# EAGLE schematic Rocket-Control (EAGLE 7.6.0)
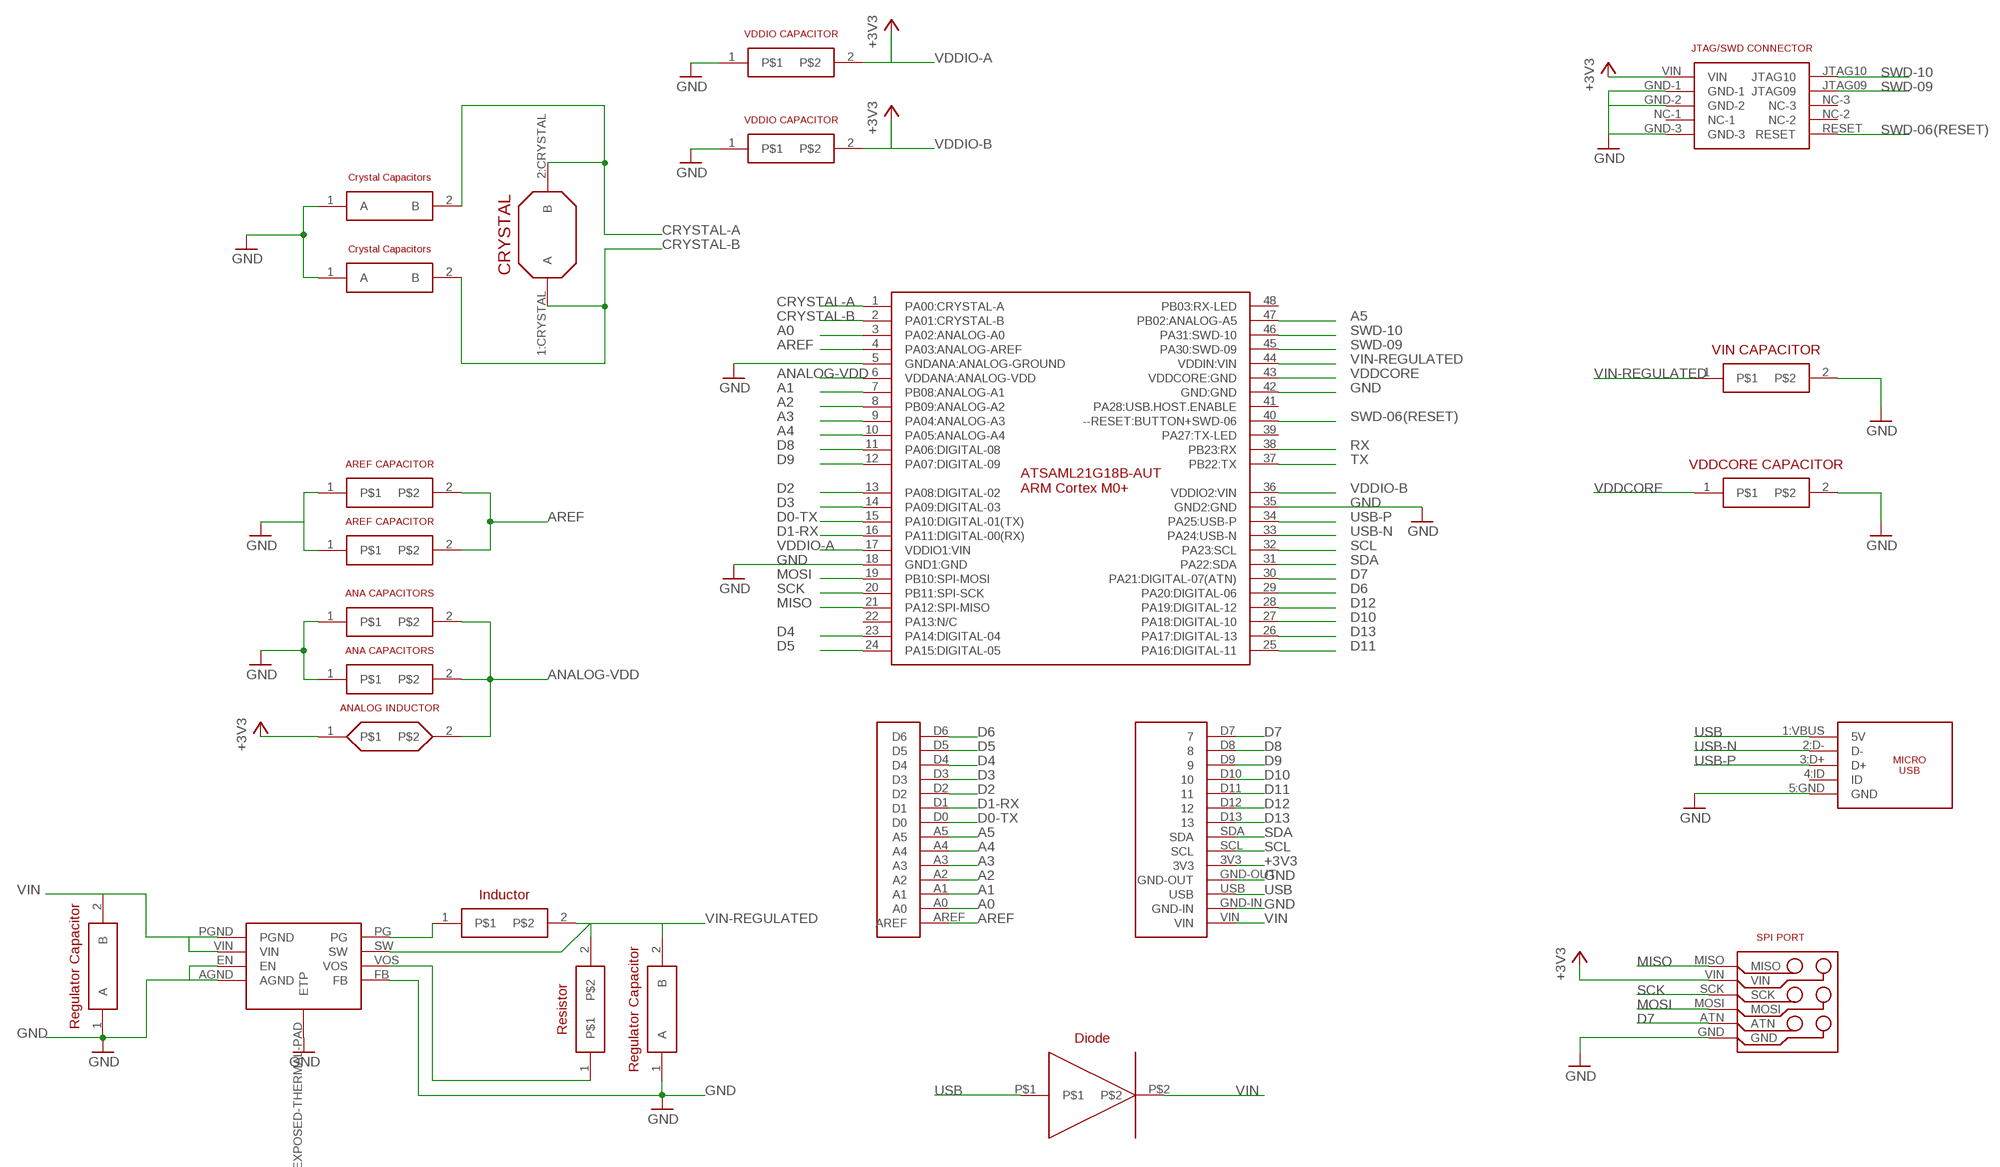
[diagram p0: schematic, sheet 1]

## Parts
U$1  ATSAML21G18B-AUT  [TQFP48]
U$2  CRYSTAL-CAPACITORS  [C0603]
U$3  CRYSTAL-CAPACITORS  [C0603]
U$4  CRYSTAL  [4-SOJ:CRYSTAL]
U$5  REGULATOR  [8-WFDFN-EXPOSED-PAD]
U$6  AREF-CAPACITORS  [C0603]
U$7  AREF-CAPACITORS  [C0603]
U$8  ANALOG-CAPACITORS  [C0603]
U$9  ANALOG-CAPACITORS  [C0603]
U$10  ANALOG-INDUCTOR  [C0603]
U$11  REGULATOR-CAPACITORS  [C0603]
U$12  REGULATOR-CAPACITORS  [C0603]
U$13  REGULATOR-INDUCTOR  [C0603]
U$14  REGULATOR-RESISTOR  [C0603]
U$15  REGULATION-DIODE  [SOD-882]
U$21  HEADER-SIDE-A  [HEADER-SIDE-A]
U$22  HEADER-SIDE-B  [HEADER-SIDE-B]
U$26  VDDIO-CAPACITOR  [C0603]
U$35  VDDIO-CAPACITOR  [C0603]
U$38  10118194-0001LF:MICRO-USB  [10118194-0001LF:MICRO-USB-B]
U$41  SPI-PORT  [SPI-PORT]
U$56  VDDCORE-CAPACITOR  [C0603]
U$57  VIN-CAPACITOR  [C0603]
U$61  JTAG-MINI  [JTAG-MINI]

## Nets
+3V3: U$10.1 U$22.3V3 U$41.VIN U$61.VIN
A0: U$1.3(PA02:ANALOG-A0) U$21.A0
A1: U$1.7(PB08:ANALOG-A1) U$21.A1
A2: U$1.8(PB09:ANALOG-A2) U$21.A2
A3: U$1.9(PA04:ANALOG-A3) U$21.A3
A4: U$1.10(PA05:ANALOG-A4) U$21.A4
A5: U$1.47(PB02:ANALOG-A5) U$21.A5
ANALOG-VDD: U$1.6(VDDANA:ANALOG-VDD) U$8.2 U$9.2 U$10.2
AREF: U$1.4(PA03:ANALOG-AREF) U$6.2 U$7.2 U$21.AREF
CRYSTAL-A: U$1.1(PA00:CRYSTAL-A) U$2.2(B) U$4.2:CRYSTAL(B)
CRYSTAL-B: U$1.2(PA01:CRYSTAL-B) U$3.2(B) U$4.1:CRYSTAL(A)
D0-TX: U$1.15(PA10:DIGITAL-01(TX)) U$21.D0
D1-RX: U$1.16(PA11:DIGITAL-00(RX)) U$21.D1
D2: U$1.13(PA08:DIGITAL-02) U$21.D2
D3: U$1.14(PA09:DIGITAL-03) U$21.D3
D4: U$1.23(PA14:DIGITAL-04) U$21.D4
D5: U$1.24(PA15:DIGITAL-05) U$21.D5
D6: U$1.29(PA20:DIGITAL-06) U$21.D6
D7: U$1.30(PA21:DIGITAL-07(ATN)) U$22.D7 U$41.ATN
D8: U$1.11(PA06:DIGITAL-08) U$22.D8
D9: U$1.12(PA07:DIGITAL-09) U$22.D9
D10: U$1.27(PA18:DIGITAL-10) U$22.D10
D11: U$1.25(PA16:DIGITAL-11) U$22.D11
D12: U$1.28(PA19:DIGITAL-12) U$22.D12
D13: U$1.26(PA17:DIGITAL-13) U$22.D13
GND: U$1.5(GNDANA:ANALOG-GROUND) U$1.18(GND1:GND) U$1.35(GND2:GND) U$1.42(GND:GND) U$2.1(A) U$3.1(A) U$5.AGND U$5.EN U$5.EXPOSED-THERMAL-PAD(ETP) U$5.FB U$6.1 U$7.1 U$8.1 U$9.1 U$11.1(A) U$12.1(A) U$22.GND-IN U$22.GND-OUT U$26.1 U$35.1 U$38.5:GND(GND) U$41.GND U$56.2 U$57.2 U$61.GND-1 U$61.GND-2 U$61.GND-3
MISO: U$1.21(PA12:SPI-MISO) U$41.MISO
MOSI: U$1.19(PB10:SPI-MOSI) U$41.MOSI
N$1: U$5.PG U$13.1
N$3: U$5.VOS U$14.1
RX: U$1.38(PB23:RX)
SCK: U$1.20(PB11:SPI-SCK) U$41.SCK
SCL: U$1.32(PA23:SCL) U$22.SCL
SDA: U$1.31(PA22:SDA) U$22.SDA
SWD-06(RESET): U$1.40(--RESET:BUTTON+SWD-06) U$61.RESET
SWD-09: U$1.45(PA30:SWD-09) U$61.JTAG09
SWD-10: U$1.46(PA31:SWD-10) U$61.JTAG10
TX: U$1.37(PB22:TX)
USB: U$15.P$1 U$22.USB U$38.1:VBUS(5V)
USB-N: U$1.33(PA24:USB-N) U$38.2:D-(D-)
USB-P: U$1.34(PA25:USB-P) U$38.3:D+(D+)
VDDCORE: U$1.43(VDDCORE:GND) U$56.1
VDDIO-A: U$1.17(VDDIO1:VIN) U$26.2 ; supply symbol labelled +3V3
VDDIO-B: U$1.36(VDDIO2:VIN) U$35.2 ; supply symbol labelled +3V3
VIN: U$5.PGND U$5.VIN U$11.2(B) U$15.P$2 U$22.VIN
VIN-REGULATED: U$1.44(VDDIN:VIN) U$5.SW U$12.2(B) U$13.2 U$14.2 U$57.1
Unconnected: U$1.22(PA13:N/C) U$1.39(PA27:TX-LED) U$1.41(PA28:USB.HOST.ENABLE) U$1.48(PB03:RX-LED) U$38.4:ID(ID) U$61.NC-1 U$61.NC-2 U$61.NC-3

## Library data of the parts
U$1 = RocketControlBoard:ATSAML21G18B-AUT
U$2 U$3 = RocketControlBoard:CRYSTAL-CAPACITORS
U$4 = RocketControlBoard:CRYSTAL
U$5 = RocketControlBoard:REGULATOR
U$6 U$7 = RocketControlBoard:AREF-CAPACITORS
U$8 U$9 = RocketControlBoard:ANALOG-CAPACITORS
U$10 = RocketControlBoard:ANALOG-INDUCTOR
U$11 U$12 = RocketControlBoard:REGULATOR-CAPACITORS
U$13 = RocketControlBoard:REGULATOR-INDUCTOR
U$14 = RocketControlBoard:REGULATOR-RESISTOR
U$15 = RocketControlBoard:REGULATION-DIODE
U$21 = RocketControlBoard:HEADER-SIDE-A
U$22 = RocketControlBoard:HEADER-SIDE-B
U$26 U$35 = RocketControlBoard:VDDIO-CAPACITOR
U$38 = RocketControlBoard:10118194-0001LF:MICRO-USB
U$41 = RocketControlBoard:SPI-PORT
U$56 = RocketControlBoard:VDDCORE-CAPACITOR
U$57 = RocketControlBoard:VIN-CAPACITOR
U$61 = RocketControlBoard:JTAG-MINI